# Altium schematic sheet TColour2to3.SchDoc: LiveDesign Evaluation - Stop Watch
size A4; Organization: Altium Limited; Address1: L3, 12a Rodborough Rd; Address2: Frenchs Forest; Address3: NSW; Address4: Australia 2086; DocumentNumber: 4; SheetNumber: 4; SheetTotal: 7
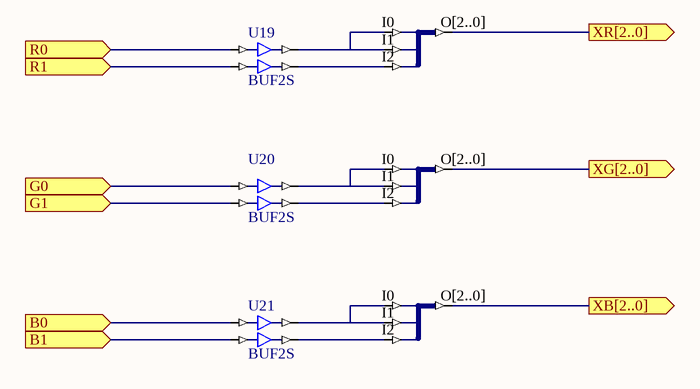
[diagram p0: TColour2to3.SchDoc]

## Parts
U16  J3S_3B  (value not drawn)
U17  J3S_3B  (value not drawn)
U18  J3S_3B  (value not drawn)
U19  BUF2S
U20  BUF2S
U21  BUF2S

## Ports
B0 (in), B1 (in), G0 (in), G1 (in), R0 (in), R1 (in), XB[2..0] (out), XG[2..0] (out), XR[2..0] (out)

## Nets
B0: U21.I0 ; port B0
B1: U21.I1 ; port B1
G0: U20.I0 ; port G0
G1: U20.I1 ; port G1
R0: U19.I0 ; port R0
R1: U19.I1 ; port R1
XB[2..0]: U18.O[2..0] ; port XB[2..0]
XG[2..0]: U17.O[2..0] ; port XG[2..0]
XR[2..0]: U16.O[2..0] ; port XR[2..0]
NetU16_I0: U16.I0 U16.I1 U19.O0
NetU16_I2: U16.I2 U19.O1
NetU17_I0: U17.I0 U17.I1 U20.O0
NetU17_I2: U17.I2 U20.O1
NetU18_I0: U18.I0 U18.I1 U21.O0
NetU18_I2: U18.I2 U21.O1

## Notes on the sheet
- Title
- Size:
- Date:
- A4
- Number:
- Time:
- Revision:
- Sheet
- of
- File:

## Library data of the parts
U16-U18 = J3S_3B: 3 Single pin inputs to single 3-Bit output bus; ArchiveName: GENERIC; VHDLIB_SIM: GENERIC_LIB; Published: 29-Jan-2004; Publisher: Altium Limited; Core Revision: 1.00.00
U19-U21 = BUF2S: 2-Bit General Purpose (Non-inverting) Buffer, Single Pin Version; ArchiveName: GENERIC; VHDLIB_SIM: GENERIC_LIB; Published: 29-Jan-2004; Publisher: Altium Limited; Core Revision: 1.00.00